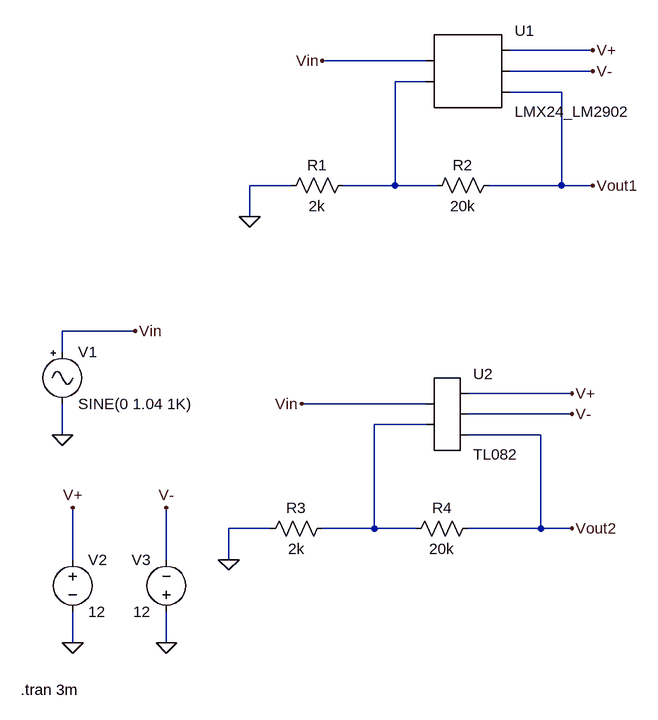
[diagram p0: schematic relat13.asc]
relat13.asc, the LTspice schematic file:
Version 4
SHEET 1 880 856
WIRE 480 -144 352 -144
WIRE 224 -128 64 -128
WIRE 480 -112 352 -112
WIRE 224 -96 176 -96
WIRE 432 -80 352 -80
WIRE 16 64 -48 64
WIRE 176 64 176 -96
WIRE 176 64 96 64
WIRE 240 64 176 64
WIRE 432 64 432 -80
WIRE 432 64 320 64
WIRE 480 64 432 64
WIRE -48 112 -48 64
WIRE -224 288 -336 288
WIRE -336 320 -336 288
WIRE 448 384 288 384
WIRE 224 400 32 400
WIRE 448 416 288 416
WIRE 224 432 144 432
WIRE -336 448 -336 400
WIRE 400 448 288 448
WIRE -16 592 -80 592
WIRE 144 592 144 432
WIRE 144 592 64 592
WIRE 208 592 144 592
WIRE 400 592 400 448
WIRE 400 592 288 592
WIRE 448 592 400 592
WIRE -320 640 -320 560
WIRE -176 640 -176 560
WIRE -80 640 -80 592
WIRE -320 768 -320 720
WIRE -176 768 -176 720
FLAG -336 448 0
FLAG 480 64 Vout1
FLAG -320 768 0
FLAG -176 768 0
FLAG -320 560 V+
FLAG -176 560 V-
FLAG 480 -144 V+
FLAG 480 -112 V-
FLAG -224 288 Vin
FLAG -48 112 0
FLAG 64 -128 Vin
FLAG 448 592 Vout2
FLAG 448 384 V+
FLAG 448 416 V-
FLAG -80 640 0
FLAG 32 400 Vin
SYMBOL AutoGenerated\\LMX24_LM2902 288 -112 R0
SYMATTR InstName U1
SYMBOL Misc\\signal -336 304 R0
WINDOW 123 0 0 Left 0
WINDOW 39 0 0 Left 0
SYMATTR InstName V1
SYMATTR Value SINE(0 1.04 1K)
SYMBOL res 112 48 R90
WINDOW 0 0 56 VBottom 2
WINDOW 3 32 56 VTop 2
SYMATTR InstName R1
SYMATTR Value 2k
SYMBOL res 336 48 R90
WINDOW 0 0 56 VBottom 2
WINDOW 3 32 56 VTop 2
SYMATTR InstName R2
SYMATTR Value 20k
SYMBOL voltage -320 624 R0
WINDOW 123 0 0 Left 0
WINDOW 39 0 0 Left 0
SYMATTR InstName V2
SYMATTR Value 12
SYMBOL voltage -176 736 R180
WINDOW 0 24 96 Left 2
WINDOW 3 24 16 Left 2
WINDOW 123 0 0 Left 0
WINDOW 39 0 0 Left 0
SYMATTR InstName V3
SYMATTR Value 12
SYMBOL res 80 576 R90
WINDOW 0 0 56 VBottom 2
WINDOW 3 32 56 VTop 2
SYMATTR InstName R3
SYMATTR Value 2k
SYMBOL res 304 576 R90
WINDOW 0 0 56 VBottom 2
WINDOW 3 32 56 VTop 2
SYMATTR InstName R4
SYMATTR Value 20k
SYMBOL AutoGenerated\\TL082 256 416 R0
SYMATTR InstName U2
TEXT -400 840 Left 2 !.tran 3m

The netlist it stands for:
* relat13.asc
* U1: LMX24_LM2902 (symbol AutoGenerated\LMX24_LM2902 not available, pins judged from their places): pin1=Vin pin2=N001 pin3=V+ pin4=V- pin5=Vout1
V1 Vin 0 SINE(0 1.04 1K)
R1 N001 0 2k
R2 Vout1 N001 20k
V2 V+ 0 12
V3 0 V- 12
R3 N002 0 2k
R4 Vout2 N002 20k
* U2: TL082 (symbol AutoGenerated\TL082 not available, pins judged from their places): pin1=Vin pin2=N002 pin3=V+ pin4=V- pin5=Vout2
.tran 3m
.backanno
.end